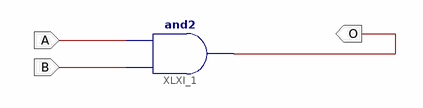
[diagram p0: schematic sheet 1]
// Xilinx ISE schematic andtest.sch (spartan6) as structural Verilog: 1 symbols, 3 ports
module andtest (
  input  A,
  input  B,
  output O
);

  and XLXI_1 (O, B, A);
endmodule
